# Altium schematic sheet RF.SchDoc: STM32WB55RG RF part
size A4; Author: PhA; SheetNumber: 3; SheetTotal: 6
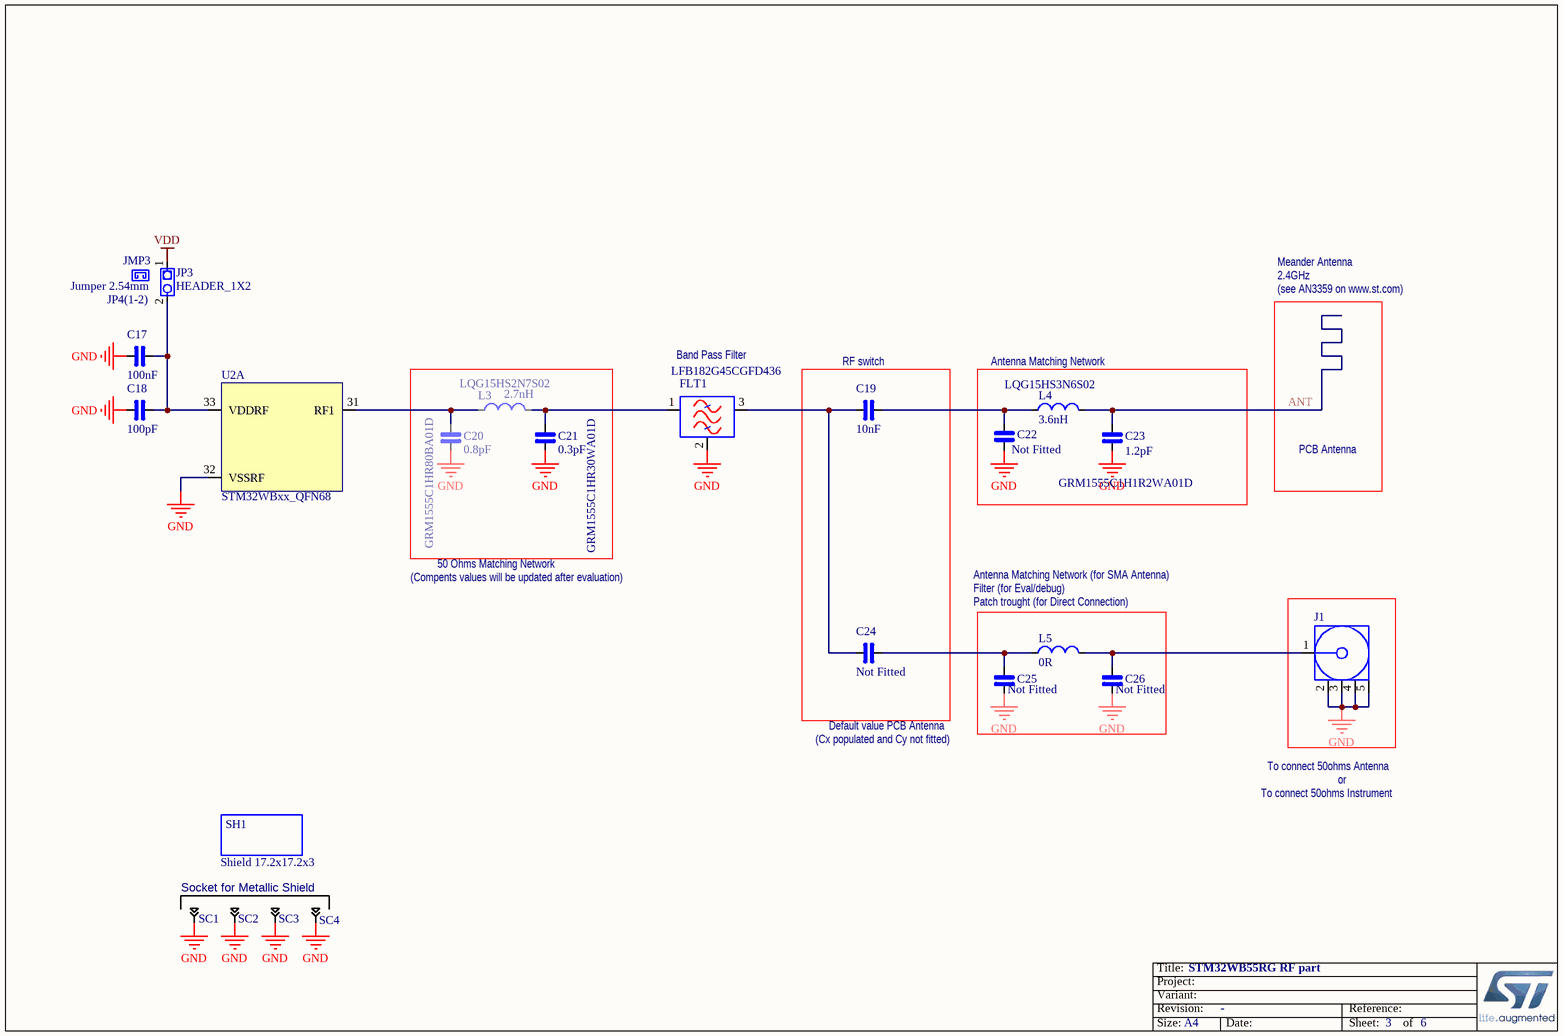
[diagram p0: RF.SchDoc]

## Parts
C17  100nF  [0603_CAP_NPOL]
C18  100pF  [0603_CAP_NPOL]
C19  10nF  [0603_CAP_NPOL]
C20  0.8pF  REF: GRM1555C1HR80BA01D  [0603_CAP_NPOL]
C21  0.3pF  REF: GRM1555C1HR30WA01D  [0603_CAP_NPOL]
C22  Fitted: Not Fitted  [0603_CAP_NPOL]
C23  1.2pF  Ref: GRM1555C1H1R2WA01D  [0603_CAP_NPOL]
C24  Fitted: Not Fitted  [0603_CAP_NPOL]
C25  Fitted: Not Fitted  [0603_CAP_NPOL]
C26  Fitted: Not Fitted  [0603_CAP_NPOL]
FLT1  LFB182G45CGFD436  [LFB182G45CGFD436]
J1  731000114  [MOLX-731000114_V]  (value not drawn)
JMP3  Jumper 2.54mm  default: JP4(1-2)  [Jumper 2.54mm BLACK]
JP3  HEADER_1X2  [GP_2x1_2mm]
L3  2.7nH  Ref: LQG15HS2N7S02  [0402_COIL]
L4  3.6nH  Ref: LQG15HS3N6S02  [0402_COIL]
L5  0R  [0402_COIL]
SC1  Shield Clip_A 3.9x1.1x1.28  [Shield Clip_A 3.9x1.1x1.28]  (value not drawn)
SC2  Shield Clip_A 3.9x1.1x1.28  [Shield Clip_A 3.9x1.1x1.28]  (value not drawn)
SC3  Shield Clip_A 3.9x1.1x1.28  [Shield Clip_A 3.9x1.1x1.28]  (value not drawn)
SC4  Shield Clip_A 3.9x1.1x1.28  [Shield Clip_A 3.9x1.1x1.28]  (value not drawn)
SH1  Shield 17.2x17.2x3  [Shield 17.2x17.2x3]
U2  STM32WBxx_QFN68  [VFQFPN68_8x8x0.1_p0.4]  (part A of 5)

## Blocks framed on the sheet
RF switch: C19 C24
Antenna Matching Network: C22 C23 L4

## Nets
GND: C17.1 C18.1 C20.1 C21.1 C22.2 C23.1 C25.1 C26.1 FLT1.2(GND) J1.2 J1.3 J1.4 J1.5 SC1.1 SC2.1 SC3.1 SC4.1 U2.32(VSSRF)
VDD: JP3.1
ANT: C23.2 L4.2
NetC17_2: C17.2 C18.2 JP3.2 U2.33(VDDRF)
NetC19_1: C19.1 C24.1 FLT1.3(I/O)
NetC19_2: C19.2 C22.1 L4.1
NetC20_2: C20.2 L3.1 U2.31(RF1)
NetC21_2: C21.2 FLT1.1(I/O) L3.2
NetC24_2: C24.2 C25.2 L5.1
NetC26_2: C26.2 J1.1 L5.2

## Notes on the sheet
- Meander Antenna
- 2.4GHz
- (see AN3359 on www.st.com)
- (near FLT1) Band Pass Filter
- PCB Antenna
- (Compents values will be updated after evaluation)
- 50 Ohms Matching Network
- Antenna Matching Network (for SMA Antenna)
- Filter (for Eval/debug)
- Patch trought (for Direct Connection)
- (near C25) (Cx populated and Cy not fitted)
- Default value PCB Antenna
- To connect 50ohms Antenna
- or
- To connect 50ohms Instrument
- Socket for Metallic Shield
- Title:
- Project:
- Size:
- Revision:
- Variant:
- A4
- -
- Date:
- Reference:
- Sheet:
- of

## Library data of the parts
C17 C18 C20-C26 = CAP_NPOL: Capacitor_not polarized
  C23: Fitted: Fitted
C19 = CAP_NPOL: Capacitor_not polarized; Ref: Murata GRM155R71H103KA88
FLT1 = LFB182G45CGFD436: Band Pass Filter Murata LFB182G45CGFD436
J1 = CMP-2000-05487-1: SMA Right-Angle PCB Jack Receptacle, Brass Body, Gold Plated, 50 Ohm, 5-Pin THD, RoHS, Tray; Manufacturer: Molex; Datasheet Version: 09/2016; Package Description: 5-Pin Through Hole Device, Body 14.8 x 6.35 mm, Pitch 2.54 mm; Datasheet URL: http://www.molex.com/webdocs/datasheets/pdf/en-us/0731000114_RF_COAX_CONNECTORS.pdf; Manufacturer URL: http://www.molex.com/; Package Reference: 731000114; Mounting Technology: ThroughHole; Package URL: http://www.molex.com/pdm_docs/sd/731000114_sd.pdf
JP3 = HEADER_1X2_L
L3-L5 = INDUCTOR_SMD_STDL
SC1-SC4 = Shield Clip_A 3.9x1.1x1.28: Harwin S0951-46R
SH1 = Shield